# EAGLE design MAPE-CUN-Large-033 (EAGLE 7.3.0)
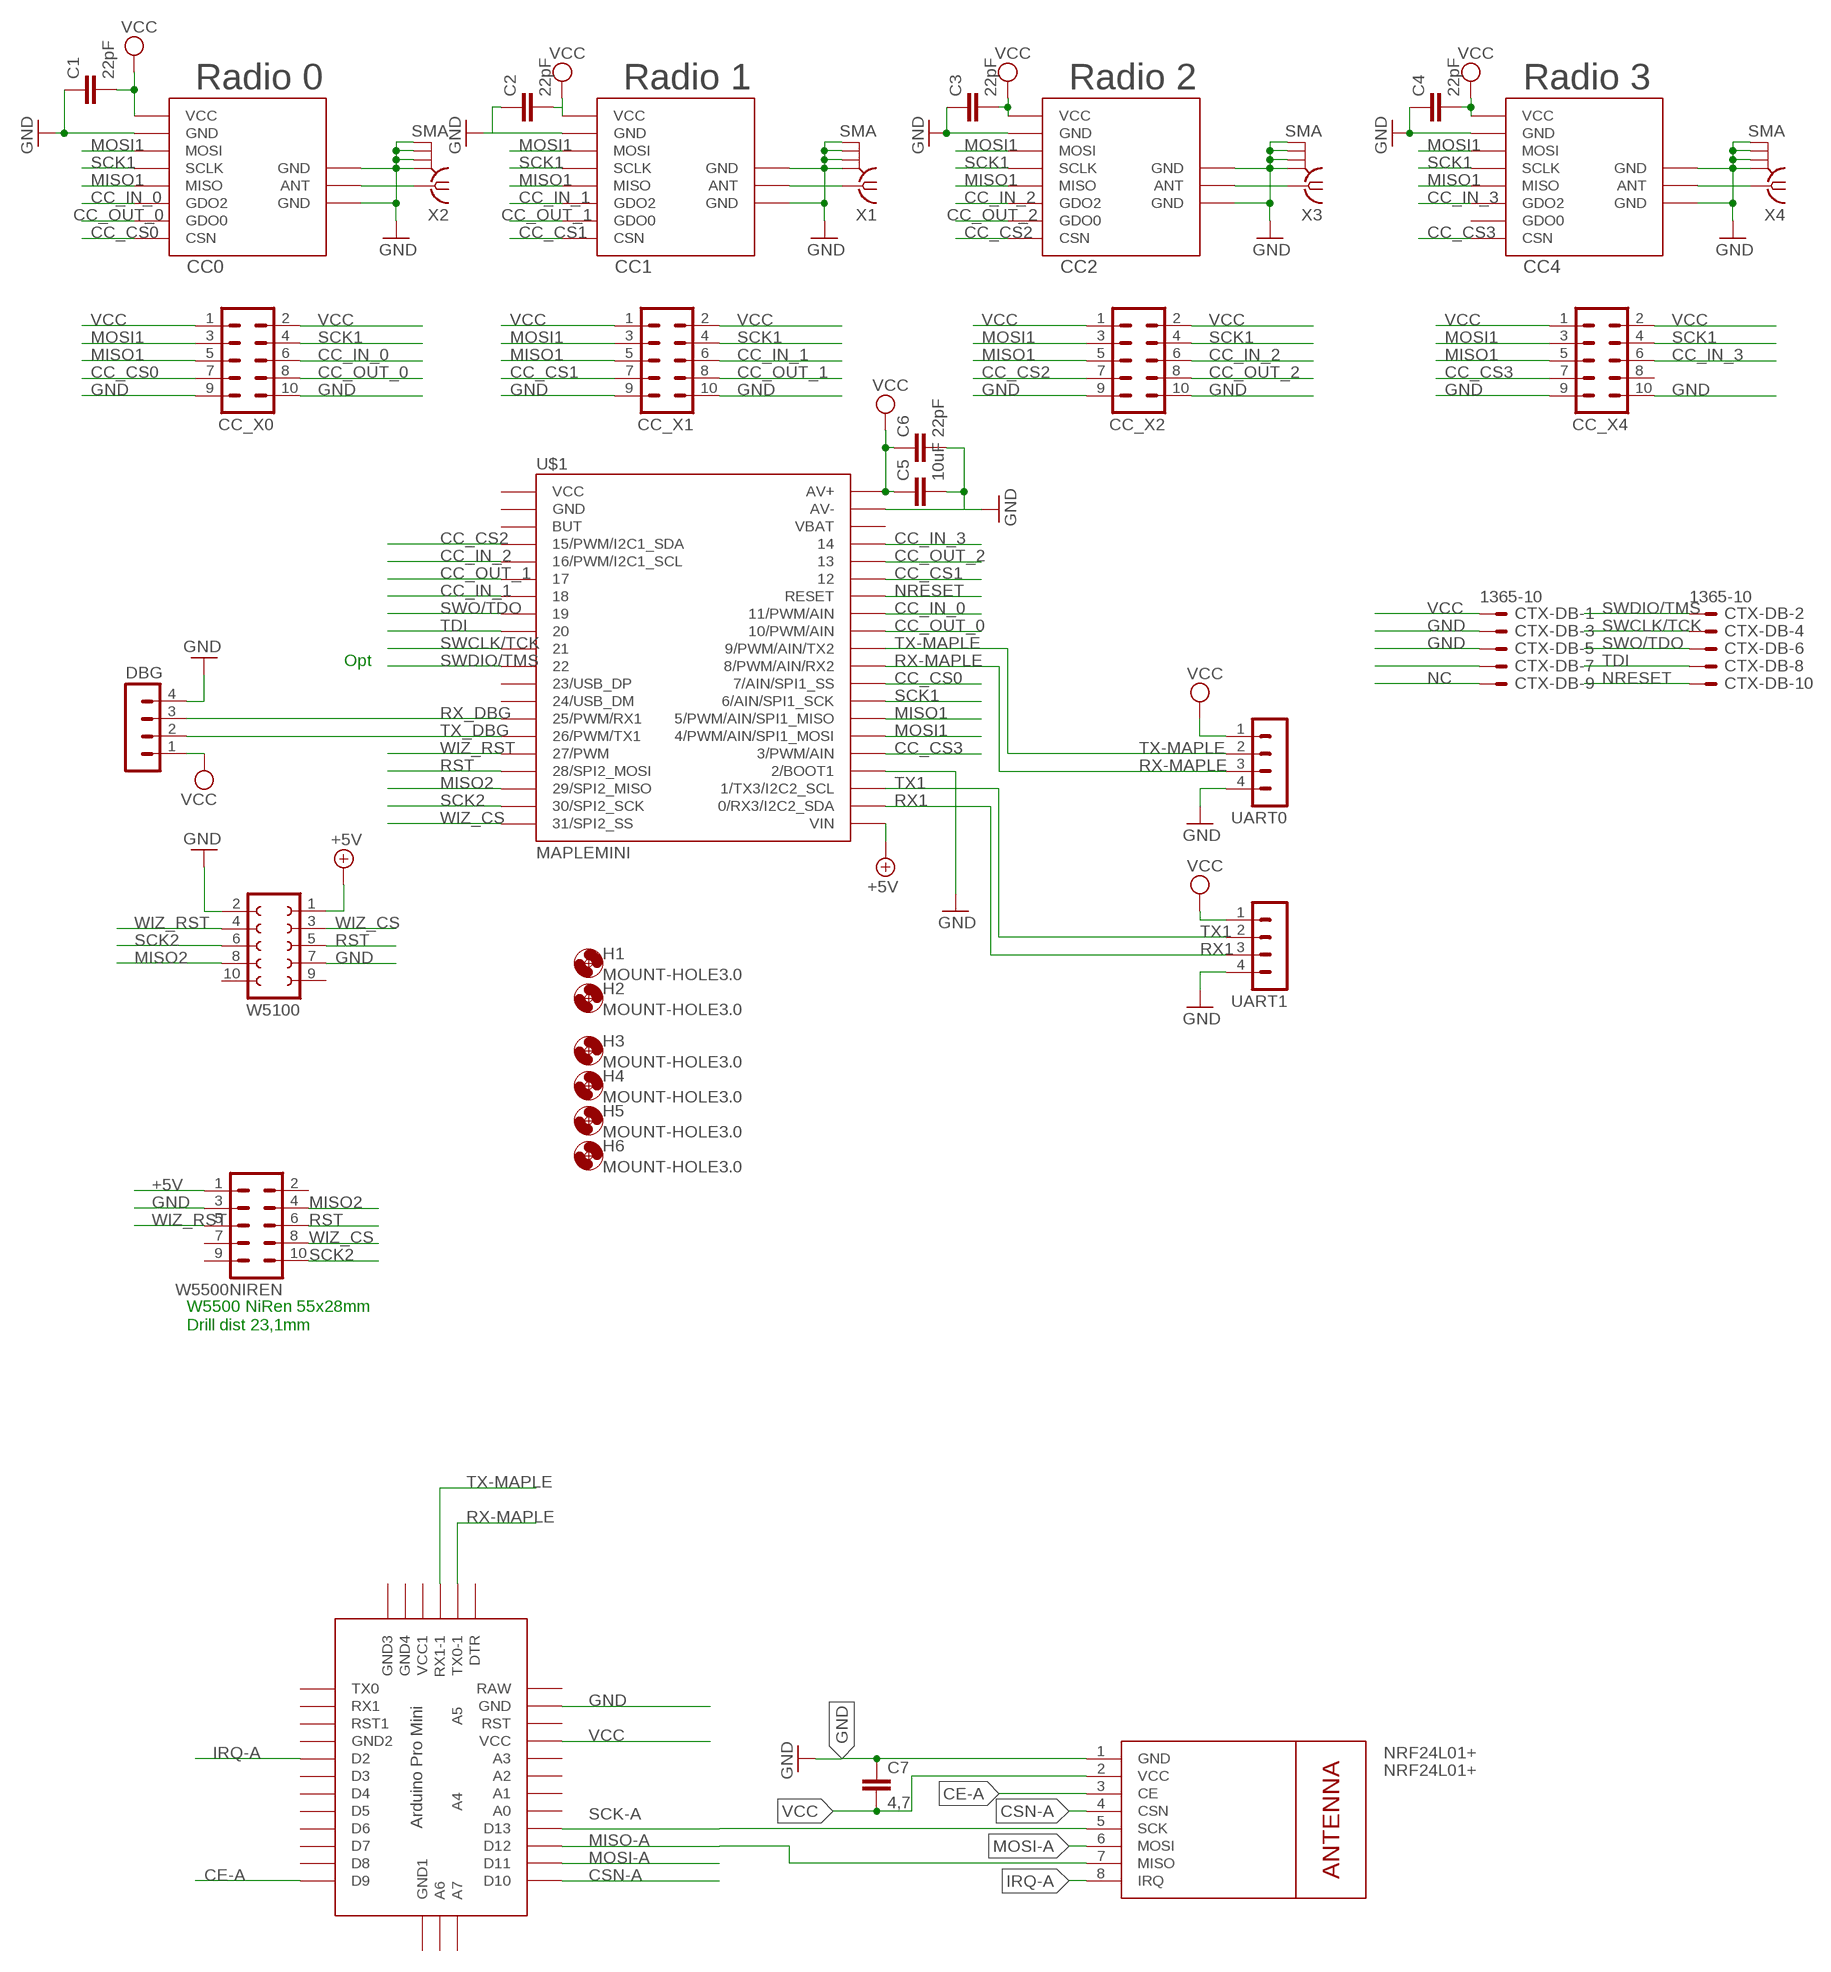
[diagram p0: schematic, sheet 1]

## Parts
C1  22pF  C-EUC0805  [C0805]
C2  22pF  C-EUC0805  [C0805]
C3  22pF  C-EUC0805  [C0805]
C4  22pF  C-EUC0805  [C0805]
C5  10uF  C-EUC1210  [C1210]
C6  22pF  C-EUC0805  [C0805]
C7  4,7  C-EUC1210  [C1210]
CC0  CC1101_MODULE1SMD  [CC1101_MODULE1_SMD]
CC1  CC1101_MODULE1SMD  [CC1101_MODULE1_SMD]
CC2  CC1101_MODULE1SMD  [CC1101_MODULE1_SMD]
CC4  CC1101_MODULE1SMD  [CC1101_MODULE1_SMD]
CC_X0  MA05-2  [MA05-2]
CC_X1  MA05-2  [MA05-2]
CC_X2  MA05-2  [MA05-2]
CC_X4  MA05-2  [MA05-2]
CTX-DB  1365-10  [1365-10]
DBG  MA04-1  [MA04-1]
H1  MOUNT-HOLE3.0  [3,0]
H2  MOUNT-HOLE3.0  [3,0]
H3  MOUNT-HOLE3.0  [3,0]
H4  MOUNT-HOLE3.0  [3,0]
H5  MOUNT-HOLE3.0  [3,0]
H6  MOUNT-HOLE3.0  [3,0]
NRF24L01+  NRF24L01+  WIRELESS-NRF24L01  [WIRELESS-NRF24L01]
U$1  MAPLEMINI  [20-DIP]
U$2  ABK-PRO-MINI  [ABK-PRO-MINI]
UART0  MA04-1  [MA04-1]
UART1  MA04-1  [MA04-1]
W5100  FE05-2  [FE05-2]
W5500NIREN  MA05-2  [MA05-2]
X1  SMA  [SMA]
X2  SMA  [SMA]
X3  SMA  [SMA]
X4  SMA  [SMA]

## Nets
+5V: U$1.21(VIN) W5100.1 W5500NIREN.1
CC_CS0: CC0.CSN CC_X0.7 U$1.29(7/AIN/SPI1_SS)
CC_CS1: CC1.CSN CC_X1.7 U$1.35
CC_CS2: CC2.CSN CC_X2.7 U$1.4(15/PWM/I2C1_SDA)
CC_CS3: CC4.CSN CC_X4.7 U$1.25(3/PWM/AIN)
CC_IN_0: CC0.GDO2 CC_X0.6 U$1.33(11/PWM/AIN)
CC_IN_1: CC1.GDO2 CC_X1.6 U$1.7
CC_IN_2: CC2.GDO2 CC_X2.6 U$1.5(16/PWM/I2C1_SCL)
CC_IN_3: CC4.GDO2 CC_X4.6 U$1.37
CC_OUT_0: CC0.GDO0 CC_X0.8 U$1.32(10/PWM/AIN)
CC_OUT_1: CC1.GDO0 CC_X1.8 U$1.6
CC_OUT_2: CC2.GDO0 CC_X2.8 U$1.36
CE-A: NRF24L01+.3(CE) U$2.D9
CSN-A: NRF24L01+.4(CSN) U$2.D10
GND: C1.1 C2.1 C3.1 C4.1 C5.2 C6.2 C7.1 CC0.GND@0(GND) CC0.GND@1(GND) CC0.GND@2(GND) CC1.GND@0(GND) CC1.GND@1(GND) CC1.GND@2(GND) CC2.GND@0(GND) CC2.GND@1(GND) CC2.GND@2(GND) CC4.GND@0(GND) CC4.GND@1(GND) CC4.GND@2(GND) CC_X0.9 CC_X0.10 CC_X1.9 CC_X1.10 CC_X2.9 CC_X2.10 CC_X4.9 CC_X4.10 CTX-DB.3 CTX-DB.5 DBG.4 NRF24L01+.1(GND) U$1.24(2/BOOT1) U$1.39(AV-) U$2.GND UART0.4 UART1.4 W5100.2 W5100.7 W5500NIREN.3 X1.GND@1 X1.GND@2 X1.GND@3 X1.GND@4 X2.GND@1 X2.GND@2 X2.GND@3 X2.GND@4 X3.GND@1 X3.GND@2 X3.GND@3 X3.GND@4 X4.GND@1 X4.GND@2 X4.GND@3 X4.GND@4
IRQ-A: NRF24L01+.8(IRQ) U$2.D2
MISO1: CC0.MISO CC1.MISO CC2.MISO CC4.MISO CC_X0.5 CC_X1.5 CC_X2.5 CC_X4.5 U$1.27(5/PWM/AIN/SPI1_MISO)
MISO2: U$1.18(29/SPI2_MISO) W5100.8 W5500NIREN.4
MISO-A: NRF24L01+.7(MISO) U$2.D12
MOSI1: CC0.MOSI CC1.MOSI CC2.MOSI CC4.MOSI CC_X0.3 CC_X1.3 CC_X2.3 CC_X4.3 U$1.26(4/PWM/AIN/SPI1_MOSI)
MOSI-A: NRF24L01+.6(MOSI) U$2.D11
N$1: CC2.ANT X3.1
N$2: CC4.ANT X4.1
N$3: CC1.ANT X1.1
N$4: CC0.ANT X2.1
N$8: CTX-DB.7
NC: CTX-DB.9
NRESET: CTX-DB.10 U$1.34(RESET)
RST: U$1.17(28/SPI2_MOSI) W5100.5 W5500NIREN.6
RX1: U$1.22(0/RX3/I2C2_SDA) UART1.3
RX-MAPLE: U$1.30(8/PWM/AIN/RX2) U$2.TX0-1 UART0.3
RX_DBG: DBG.3 U$1.14(25/PWM/RX1)
SCK1: CC0.SCLK CC1.SCLK CC2.SCLK CC4.SCLK CC_X0.4 CC_X1.4 CC_X2.4 CC_X4.4 U$1.28(6/AIN/SPI1_SCK)
SCK2: U$1.19(30/SPI2_SCK) W5100.6 W5500NIREN.10
SCK-A: NRF24L01+.5(SCK) U$2.D13
SWCLK/TCK: CTX-DB.4 U$1.10
SWDIO/TMS: CTX-DB.2 U$1.11
SWO/TDO: CTX-DB.6 U$1.8
TDI: CTX-DB.8 U$1.9
TX1: U$1.23(1/TX3/I2C2_SCL) UART1.2
TX-MAPLE: U$1.31(9/PWM/AIN/TX2) U$2.RX1-1 UART0.2
TX_DBG: DBG.2 U$1.15(26/PWM/TX1)
VCC: C1.2 C2.2 C3.2 C4.2 C5.1 C6.1 C7.2 CC0.VCC CC1.VCC CC2.VCC CC4.VCC CC_X0.1 CC_X0.2 CC_X1.1 CC_X1.2 CC_X2.1 CC_X2.2 CC_X4.1 CC_X4.2 CTX-DB.1 DBG.1 NRF24L01+.2(VCC) U$1.40(AV+) U$2.VCC UART0.1 UART1.1
WIZ_CS: U$1.20(31/SPI2_SS) W5100.3 W5500NIREN.8
WIZ_RST: U$1.16(27/PWM) W5100.4 W5500NIREN.5
Unconnected: CC4.GDO0 CC_X4.8 U$1.1(VCC) U$1.2(GND) U$1.3(BUT) U$1.12(23/USB_DP) U$1.13(24/USB_DM) U$1.38(VBAT) U$2.A0 U$2.A1 U$2.A2 U$2.A3 U$2.A4 U$2.A5 U$2.A6 U$2.A7 U$2.D3 U$2.D4 U$2.D5 U$2.D6 U$2.D7 U$2.D8 U$2.DTR U$2.GND1(GND2) U$2.GND2(GND3) U$2.GND3(GND4) U$2.GND4(GND1) U$2.RAW U$2.RST U$2.RST1 U$2.RX1 U$2.TX0 U$2.VCC1 W5100.9 W5100.10 W5500NIREN.2 W5500NIREN.7 W5500NIREN.9

## Notes on the sheet
- Radio 0 | Radio 1 | Radio 2 | Radio 3
- Opt
- W5500 NiRen 55x28mm
  Drill dist 23,1mm

## Library data of the parts
C1-C7 = rcl:C-EU: CAPACITOR, European symbol
CC0 CC1 CC2 CC4 = wireless:CC1101_MODULE1: CC1101 wireless module for 433/868 MHz (sold from Aliexpress). DIL version for mounting with pin header (and SMD soldering) and SMD only variant available.
CC_X0 CC_X1 CC_X2 CC_X4 W5500NIREN = con-lstb:MA05-2: PIN HEADER; OC_FARNELL: unknown; OC_NEWARK: unknown
CTX-DB = con-leotronics:1365-10: DUAL ROW STRAIGHT HEADER 1364 SERIES. 1.27mm x 1.27mm. Without Fixing Post. SMT Source: http://www.leotronics.co.uk/Conexcon/Data%20Sheets/sec.%20A/1364ing.pdf; OC_FARNELL: unknown; OC_NEWARK: unknown
DBG UART0 UART1 = con-lstb:MA04-1: PIN HEADER; OC_FARNELL: unknown; OC_NEWARK: unknown
H1-H6 = holes:MOUNT-HOLE: MOUNTING HOLE with drill center marker
NRF24L01+ = diy-modules:WIRELESS-NRF24L01: 2.4 GHz Wireless Module based on NRF24L01 chip
U$1 = maplemini-small:MAPLEMINI
U$2 = Arduino-clone:ABK-PRO-MINI: ABK Pro-Mini Arduino Clone
W5100 = con-lsta:FE05-2: FEMALE HEADER; OC_FARNELL: unknown; OC_NEWARK: unknown
X1-X4 = sma:SMA: SMA 50 Ohm end launch jack receptacle - round contact

## Net classes
0 default: width 0.406 mm
1 PWR: width 0.305 mm

## Board
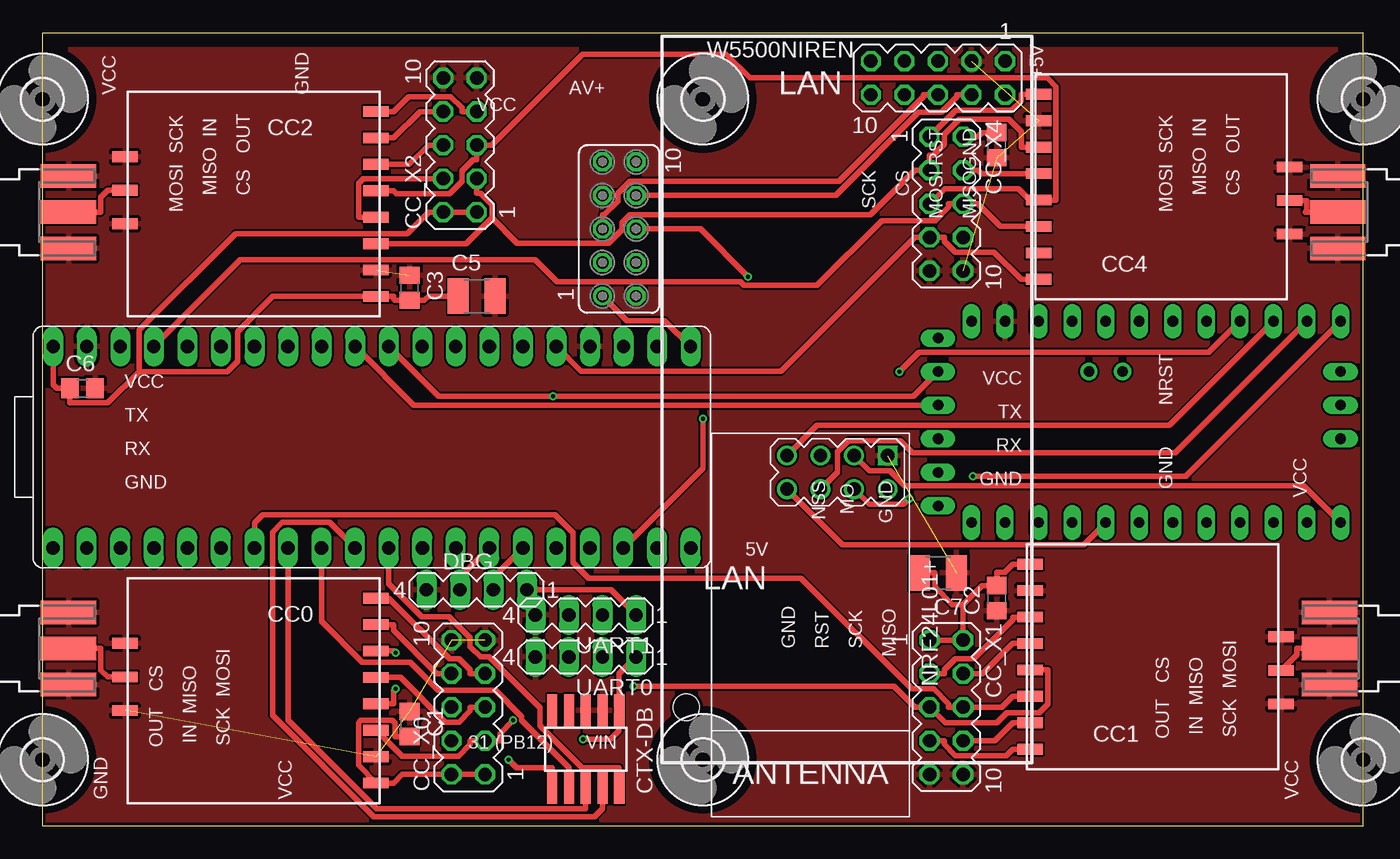
[diagram p1: board, top side]
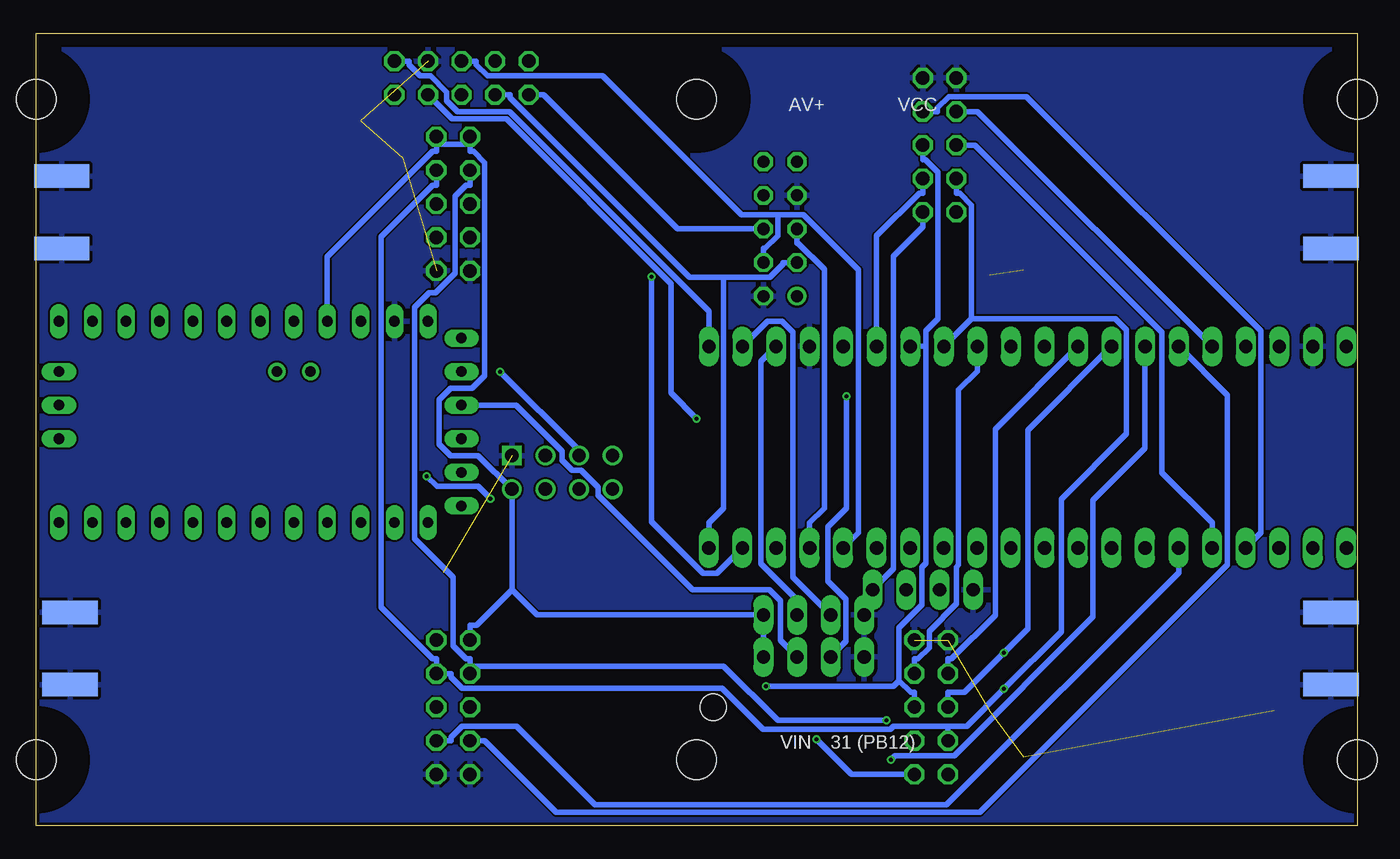
[diagram p2: board, bottom side, seen from below]

Size 100 x 60 mm. Coordinates in mm from the lower left corner, seen from the top.
Outline: 0,60 0,0 100,0 100,60 0,60
Copper layers (1*16): Top 0.035mm / dielectric 1.5mm / Bottom 0.035mm
Design rules "SeeedStudio_2layer_DRU_no_angle_20140221": minimum track width 6mil, minimum drill 12mil, track to track 6mil, track to pad 6mil, pad to pad 6mil, via to via 6mil, smd to smd 0mil, copper to edge 10mil, drill to drill 10mil, minimum pad ring 10mil, minimum via ring 6mil, stop-mask expansion 2mil, vias tented up to drill 100mil, thermal gap 10mil
Holes 2 mm at 48.76,8.97
tRestrict: area -0.1,59.1 to 100.2,59.8
bRestrict: area -0.1,59.1 to 100.2,59.8

### Footprints (pad centres in the part's own frame; a part is rotated, then mirrored left to right if it is on the bottom)
C0805 = smd 1.3 x 1.5: 1 -0.95,0; 2 0.95,0
C1210 = smd 1.6 x 2.7: 1 -1.4,0; 2 1.4,0
CC1101_MODULE1_SMD = smd 1.93 x 0.813: ANT 19,5.96; CSN 0,0; GDO0 0,2; GDO2 0,4; GND@0 0,12; GND@1 19,8.5; GND@2 19,3.42; MISO 0,6; MOSI 0,10; SCLK 0,8; VCC 0,14
MA05-2 = drill 1.016 octagon: 1 -5.08,-1.27; 2 -5.08,1.27; 3 -2.54,-1.27; 4 -2.54,1.27; 5 0,-1.27; 6 0,1.27; 7 2.54,-1.27; 8 2.54,1.27; 9 5.08,-1.27; 10 5.08,1.27
1365-10 = smd 0.76 x 2.4: 1 -2.54,-2.95; 2 -2.54,2.95; 3 -1.27,-2.95; 4 -1.27,2.95; 5 0,-2.95; 6 0,2.95; 7 1.27,-2.95; 8 1.27,2.95; 9 2.54,-2.95; 10 2.54,2.95
MA04-1 = drill 1.016 long: 1 -3.81,0; 2 -1.27,0; 3 1.27,0; 4 3.81,0
3,0 = hole 3: 0,0
WIRELESS-NRF24L01 = drill 1 square: 1 -12.7,6.35 | drill 1: 2 -10.16,6.35; 3 -12.7,3.81; 4 -10.16,3.81; 5 -12.7,1.27; 6 -10.16,1.27; 7 -12.7,-1.27; 8 -10.16,-1.27
20-DIP = drill 1.016 pad 1.27 long: 1 -24.13,-7.62; 2 -21.59,-7.62; 3 -19.05,-7.62; 4 -16.51,-7.62; 5 -13.97,-7.62; 6 -11.43,-7.62; 7 -8.89,-7.62; 8 -6.35,-7.62; 9 -3.81,-7.62; 10 -1.27,-7.62; 11 1.27,-7.62; 12 3.81,-7.62; 13 6.35,-7.62; 14 8.89,-7.62; 15 11.43,-7.62; 16 13.97,-7.62; 17 16.51,-7.62; 18 19.05,-7.62; 19 21.59,-7.62; 20 24.13,-7.62 | drill 1 pad 1.27 long: 21 24.13,7.62; 22 21.59,7.62; 23 19.05,7.62; 24 16.51,7.62; 25 13.97,7.62; 26 11.43,7.62; 27 8.89,7.62; 28 6.35,7.62; 29 3.81,7.62; 30 1.27,7.62; 31 -1.27,7.62; 32 -3.81,7.62; 33 -6.35,7.62; 34 -8.89,7.62; 35 -11.43,7.62; 36 -13.97,7.62; 37 -16.51,7.62; 38 -19.05,7.62; 39 -21.59,7.62; 40 -24.13,7.62
ABK-PRO-MINI = drill 0.8 long: A0 10.16,-3.81; A1 10.16,-6.35; A2 10.16,-8.89; A3 10.16,-11.43; A6 3.81,-21.59; A7 6.35,-21.59; D2 -5.08,-3.81; D3 -5.08,-6.35; D4 -5.08,-8.89; D5 -5.08,-11.43; D6 -5.08,-13.97; D7 -5.08,-16.51; D8 -5.08,-19.05; D9 -5.08,-21.59; D10 10.16,-21.59; D11 10.16,-19.05; D12 10.16,-16.51; D13 10.16,-13.97; DTR 8.89,8.89; GND 10.16,3.81; GND1 -5.08,-1.27; GND2 -3.81,8.89; GND3 -1.27,8.89; GND4 1.27,-21.59; RAW 10.16,6.35; RST 10.16,1.27; RST1 -5.08,1.27; RX1 -5.08,3.81; RX1-1 3.81,8.89; TX0 -5.08,6.35; TX0-1 6.35,8.89; VCC 10.16,-1.27; VCC1 1.27,8.89 | drill 0.8: A4 6.35,-5.08; A5 6.35,-2.54
FE05-2 = drill 0.914: 1 -5.08,1.27 | drill 0.914 octagon: 2 -5.08,-1.27; 3 -2.54,1.27; 4 -2.54,-1.27; 5 0,1.27; 6 0,-1.27; 7 2.54,1.27; 8 2.54,-1.27; 9 5.08,1.27; 10 5.08,-1.27
SMA = smd 4.191 x 1.778: 1 2.115,0; GND@1 2.115,2.733; GND@2 2.115,-2.733 | smd 4.191 x 1.778 bottom: GND@3 2.115,2.733; GND@4 2.115,-2.733

### Placement (x,y rotation side)
C1  27.8,7.71 270 top
C2  72.25,17.23 90 top
C3  27.8,40.73 270 top
C4  72.25,51.52 90 top
C5  32.88,40.09 0 top
C6  3.03,33.11 0 top
C7  67.8,19.13 180 top
CC0  25.26,17.23 180 top
CC1  74.79,5.8 0 top
CC2  25.26,54.06 180 top
CC4  75.42,41.36 0 top
CC_X0  32.24,8.97 90 top
CC_X1  68.44,8.97 270 top
CC_X2  31.61,51.52 90 top
CC_X4  68.44,47.08 270 top
CTX-DB  41.13,5.8 180 top
DBG  32.88,17.86 180 top
H1  100,5 0 top
H2  100,55 90 top
H3  0,5 0 top
H4  0,55 0 top
H5  50,5 0 top
H6  50,55 0 top
NRF24L01+  57.64,15.32 270 top
U$1  24.94,28.66 0 top
U$2  76.69,28.02 90 top
UART0  41.13,12.79 180 top
UART1  41.13,15.96 180 top
W5100  43.67,45.17 90 top
W5500NIREN  67.8,56.6 180 top
X1  99.55,13.42 180 top
X2  -0.14,13.42 0 top
X3  -0.14,46.44 0 top
X4  100.19,46.44 180 top

### Tracks (layer width: path | path; a pad name or v marks a point on that pad's centre or on a via)
+5V
  Top 0.406: W5100.1 44.26,38.24 47.12,38.24 U$1.21
  Bottom 0.406: U$1.21 49.07,38.14 49.07,38.96 64.18,54.06 68.12,54.06 68.92,54.86 68.92,55.53 70.14,56.75 70.93,56.75 71.77,57.59 71.77,57.87 W5500NIREN.1
CC_CS0
  Top 0.406: CC_X0.7 32.4,11.51 32.4,11.79 31.56,12.63 30.82,12.63 26.22,17.23 CC0.CSN
  Bottom 0.406: U$1.29 28.75,34.42 30.17,33 30.17,19.74 30.34,19.57 30.34,16.79 32.4,14.73 32.4,13.48 33.24,12.63 33.52,12.63 CC_X0.7
CC_CS1
  Top 0.406: CC1.CSN 73.47,5.8 72.98,5.32 69.13,5.32 68.29,6.16 68.29,6.44 CC_X1.7
  Bottom 0.406: CC_X1.7 66.05,6.44 60.65,1.03 28.57,1.03 9.82,19.77 9.82,32.59 U$1.35
CC_CS2
  Top 0.406: CC2.CSN 26.58,54.06 27.71,55.19 30.91,55.19 31.76,54.34 31.76,54.06 CC_X2.7
  Bottom 0.406: CC_X2.7 31.76,54.06 31.76,54.33 30.9,55.19 25.02,55.19 7.28,37.45 7.28,22.19 U$1.4
CC_CS3
  Top 0.406: U$1.25 40.8,34.4 55.91,34.4 66.05,44.54 CC_X4.7 68.29,44.54 68.29,44.26 69.13,43.42 72.05,43.42 74.1,41.36 CC4.CSN
CC_IN_0  (via drill 0.3 pad 0.61)
  Top 0.406: CC0.GDO2 26.58,13.23 26.7,13.11 v26.73,13.11
  Bottom 0.406: U$1.33 24.94,29.93 24.94,14.9 v26.73,13.11 29.75,10.09 30.97,10.09 CC_X0.6
CC_IN_1
  Top 0.406: U$1.7 16.05,22.92 16.66,23.52 38.83,23.52 40.18,22.17 40.18,19.91 41.35,18.75 57.44,18.75 65.82,10.36 67.48,10.36 68.59,9.25 68.59,8.97 CC_X1.6 72.64,8.97 73.47,9.8 CC1.GDO2
CC_IN_2
  Top 0.406: CC_X2.6 29.22,51.52 27.76,50.06 CC2.GDO2
  Bottom 0.406: U$1.5 10.97,22.92 14.78,26.73 14.78,37.36 28.94,51.52 CC_X2.6
CC_IN_3
  Top 0.406: U$1.37 14.97,42.82 37.32,42.82 38.96,41.18 52.86,41.18 53.13,40.91 58.65,40.91 63.55,45.8 67.6,45.8 68.59,46.8 68.59,47.08 CC_X4.6 70.83,47.08 72.54,45.36 74.1,45.36 CC4.GDO2
CC_OUT_0
  Top 0.406: CC0.GDO0 26.58,15.23 26.58,14.79 29.86,11.51 CC_X0.8
  Bottom 0.406: CC_X0.8 30.97,12.63 30.7,12.63 27.38,15.95 27.38,30.03 U$1.32
CC_OUT_1
  Top 0.406: CC1.GDO0 73.47,7.8 72.1,6.44 CC_X1.8
  Bottom 0.406: U$1.6 13.51,19.16 31.08,1.59 57.69,1.59 63.65,7.55 67.75,7.55 68.59,6.71 68.59,6.44 CC_X1.8
CC_OUT_2
  Top 0.406: CC2.GDO0 26.58,52.06 28.58,54.06 CC_X2.8
  Bottom 0.406: U$1.36 28.75,54.06 CC_X2.8
CE-A
  Top 0.406: U$2.D9 95.48,25.75 65.3,25.75 64.17,26.87 62.61,26.87 NRF24L01+.3
CSN-A  (via drill 0.3 pad 0.61)
  Top 0.406: v65.62,24.76 65.19,24.32 62.62,24.32 NRF24L01+.4 | U$2.D10 86.57,26.47 v70.45,26.47
  Bottom 0.406: v70.45,26.47 69.67,25.68 66.55,25.68 v65.62,24.76
GND  (9 unrouted)
  pour Bottom: -0.14,59.78 -0.14,0.08 100.19,0.08 100.19,59.78
  pour Top: -0.14,0.08 -0.14,59.78 100.19,59.78 100.19,0.08
IRQ-A
  Top 0.406: U$2.D2 78.84,21.28 60.58,21.28 NRF24L01+.8
MISO1  (via drill 0.3 pad 0.61)
  Top 0.406: v44.75,10.56 64.47,10.56 66.05,8.97 CC_X1.5 68.36,7.79 72.25,7.79 73.02,8.56 75.47,8.56 76.11,9.2 76.11,11.8 CC1.MISO | CC_X0.5 32.4,8.97 32.4,8.7 31.56,7.85 30.5,7.85 27.13,11.23 CC0.MISO | CC2.MISO 26.58,48.06 26.8,47.84 30.83,47.84 31.76,48.78 31.76,49.56 32.6,50.4 32.88,50.4 CC_X2.5 34,51.52 40.89,58.41 51.75,58.41 53.56,56.6 76.07,56.6 76.75,55.92 76.75,47.36 76.61,47.36 CC4.MISO 75.09,47.36 74.77,47.36 73.9,48.22 68.32,48.22 CC_X4.5
  Bottom 0.406: 34.67,10.97 33.79,10.09 33.52,10.09 CC_X0.5 | 32.66,36.28 32.66,19.87 32.96,19.57 32.96,16.71 34.67,15 34.67,10.97 | v44.75,10.56 35.09,10.56 34.67,10.97 | 32.66,36.28 U$1.27 | 32.66,36.28 32.66,37.45 31.75,38.37 31.75,49.48 32.67,50.4 32.88,50.4 CC_X2.5
MISO2  (via drill 0.3 pad 0.61)
  Top 0.406: v50,30.82 50,27.05 U$1.18 | W5100.8 46.01,47.71 60.06,47.71 66.34,53.99 68.05,53.99 69.23,55.17 69.23,55.33 W5500NIREN.4
  Bottom 0.406: W5500NIREN.4 68.52,53.5 64.41,53.5 51.94,41.04 51.94,32.76 v50,30.82
MISO-A
  Top 0.406: U$2.D12 85.33,30.31 58.66,30.31 NRF24L01+.7
MOSI1  (via drill 0.3 pad 0.61)
  Top 0.406: v35.62,7.97 34.63,6.98 34.63,6.44 CC_X0.3 32.4,6.44 32.4,6.16 31.5,5.26 27.23,5.26 CC0.MOSI | 34.03,46.01 32.08,44.06 CC2.MOSI | 34.03,46.01 34.03,46.99 33.16,47.86 32.88,47.86 CC_X2.3 | 34.03,46.01 35.94,44.1 42.88,44.1 43.88,45.1 43.88,45.65 44.49,46.26 62.69,46.26 66.05,49.62 CC_X4.3 67.17,50.73 67.45,50.73 68.29,51.57 68.29,52.35 69.41,53.48 73.17,53.48 74.1,52.54 74.1,51.36 CC4.MOSI | CC1.MOSI 73.47,15.8 73.47,15.59 70.52,12.63 69.13,12.63 68.29,11.79 68.29,11.51 CC_X1.3
  Bottom 0.406: 67.17,12.07 47.95,12.07 43.85,7.97 v35.62,7.97 | 67.17,12.07 67.17,12.63 67.44,12.63 68.44,13.63 68.44,18.8 71.37,21.74 71.37,39.25 70.28,40.35 69.77,40.35 68.29,41.83 68.29,47.66 67.45,48.5 67.17,48.5 CC_X4.3 | CC_X1.3 67.17,12.07 | CC_X2.3 32.88,47.86 33.15,47.86 36.37,44.64 U$1.26
MOSI-A
  Top 0.406: U$2.D11 85.79,28.23 65.86,28.23 64.95,29.15 61.01,29.15 60.19,28.33 60.19,26.75 NRF24L01+.6
N$1
  Top 0.406: X3.1 4.43,46.44 4.43,47.59 4.94,48.1 CC2.ANT
N$2
  Top 0.406: CC4.ANT 95.75,47.32 95.75,46.56 95.62,46.44 X4.1
N$3
  Top 0.406: X1.1 94.99,13.42 94.99,12.96 CC1.ANT
N$4
  Top 0.406: CC0.ANT 4.94,11.27 4.43,11.78 4.43,13.42 X2.1
NRESET  (via drill 0.3 pad 0.61)
  Top 0.406: CTX-DB.10 38.59,4.41 35.91,4.41 v35.31,5.01
  Bottom 0.406: U$1.34 16.05,28.56 19.99,24.63 19.99,15.83 30.5,5.32 35,5.32 v35.31,5.01
RST
  Top 0.406: W5100.5 42.41,46.24 42.54,46.24 43.58,47.28 43.58,47.87 44.49,48.78 60.29,48.78 66.69,55.17 66.69,55.33 W5500NIREN.6
  Bottom 0.406: U$1.17 41.45,22.92 40.34,24.03 40.34,42.13 42.31,44.1 42.41,44.1 W5100.5
RX1
  Bottom 0.406: UART1.3 42.72,18.82 42.72,37.37 43.53,38.18 44.63,38.18 U$1.22
RX-MAPLE  (via drill 0.3 pad 0.61)
  Top 0.406: U$2.TX0-1 65.93,32.5 v38.67,32.5 29.99,32.5 U$1.30
  Bottom 0.406: UART0.3 38.69,13.96 38.69,17.14 40.06,18.51 40.06,22.64 38.67,24.03 v38.67,32.5
RX_DBG
  Top 0.406: U$1.14 31.61,18.82 DBG.3
SCK1  (via drill 0.3 pad 0.61)
  Top 0.406: CC_X4.4 70.83,49.62 71.08,49.36 CC4.SCLK | CC0.SCLK 26.58,9.23 26.58,10.21 v26.74,10.36 | CC1.SCLK 73.47,13.8 71.18,11.51 CC_X1.4 | CC2.SCLK 23.94,46.06 23.94,48.64 24.28,48.98 CC_X2.4
  Bottom 0.406: 30.97,7.55 35.11,7.55 35.35,7.31 44.98,7.31 48.07,10.4 67.75,10.4 68.59,11.24 68.59,11.51 CC_X1.4 69.71,12.63 69.98,12.63 73.9,16.55 73.9,44.59 69.99,48.5 69.71,48.5 CC_X4.4 | 30.97,7.55 29.54,7.55 v26.74,10.36 22.4,14.69 22.4,24.73 17.46,29.66 17.46,37.54 18.31,38.39 29.18,38.39 | 29.18,38.39 U$1.28 | 29.18,38.39 29.18,46.98 30.07,47.86 30.34,47.86 CC_X2.4 | CC_X0.4 30.97,7.55
SCK2  (via drill 0.3 pad 0.61)
  Top 0.406: W5100.6 49.81,45.17 v53.41,41.57
  Bottom 0.406: v53.41,41.57 53.41,23.02 49.51,19.12 48.45,19.12 U$1.19 | W5500NIREN.10 61.61,55.33 51.45,45.17 W5100.6
SCK-A  (via drill 0.3 pad 0.61)
  Top 0.406: U$2.D13 88.32,35.84 66.35,35.84 v64.89,34.38
  Bottom 0.406: v64.89,34.38 58.91,28.41 NRF24L01+.5
SWCLK/TCK
  Top 0.406: CTX-DB.4 42.41,1.29 41.81,0.7 25.09,0.7 17.43,8.36 17.43,22.22 18.17,22.96 21.75,22.96 U$1.10
SWDIO/TMS
  Top 0.406: CTX-DB.2 43.67,4.41 40.85,4.41 37.66,7.59 37.66,8.95 33.83,12.79 33.16,12.79 32.4,13.55 32.4,14.21 30.78,15.83 28.7,15.83 26.21,18.32 U$1.11
SWO/TDO
  Top 0.406: CTX-DB.6 41.13,1.29 25.3,1.29 18.59,8.01 U$1.8
TDI
  Top 0.406: U$1.9 21.13,15.47 24.22,12.39 27.82,12.39 29.96,10.24 34.29,10.24 36.28,8.25 36.28,7.99 39.87,4.41 CTX-DB.8
TX1
  Bottom 0.406: U$1.23 45.12,35.15 45.12,19.83 42.41,17.11 UART1.2
TX-MAPLE
  Top 0.406: U$2.RX1-1 66.14,31.83 28.12,31.83 U$1.31
  Bottom 0.406: UART0.2 43.67,14.05 43.67,17.04 44.49,17.85 50.32,17.85 57.48,25.02 57.48,25.64 58.76,26.91 59.43,26.91 60.19,27.67 60.19,28.34 63.68,31.83 U$2.RX1-1
TX_DBG
  Top 0.406: U$1.15 34.15,18.82 DBG.2
VCC  (via drill 0.3 pad 0.61)
  Top 0.406: v40.92,6.54 43.03,6.54 43.67,7.19 CTX-DB.1 43.67,11.51 UART0.1 | 69.71,16.75 CC_X1.2 68.29,14.05 CC_X1.1 | DBG.1 43.04,17.86 UART1.1 | CC_X0.1 CC_X0.2 27.25,3.9 26.58,3.23 CC0.VCC 23.93,4.56 23.93,7.81 24.11,7.99 26.46,7.99 26.69,7.76 26.69,6.75 C1.2 | CC4.VCC 74.1,55.36 74.1,54.88 73.37,54.15 69.17,54.15 CC_X4.1 | 7.32,34.38 13.99,34.38 14.78,35.18 14.78,37.39 17.45,40.06 CC2.VCC 26.58,40.06 26.58,39.89 26.69,39.78 C3.2 28.91,39.78 29.22,40.09 30.32,40.09 C5.1 | 7.32,34.38 4.94,32 2.08,32 C6.1 1.08,33.11 0.81,33.37 U$1.40 | 7.32,34.38 7.32,37.53 14.62,44.82 27.6,44.82 29.22,46.44 CC_X2.2 CC_X2.1 | C7.2 67.56,19.13 67.56,18.09 68.91,16.75 69.71,16.75 | 69.71,16.75 71.14,18.18 C2.2 72.25,19.19 72.86,19.19 73.47,19.8 CC1.VCC | C4.2 71.14,52.47 70.83,52.16 CC_X4.2
  Bottom 0.406: v40.92,6.54 38.27,3.9 CC_X0.1 | UART0.1 UART1.1 62.1,15.96 64,17.86 | 64,17.86 NRF24L01+.2 66.53,28.02 68.63,28.02 69.49,28.89 69.49,32.24 68.62,33.11 66.99,33.11 66.04,34.05 66.04,50.18 66.9,51.04 67.17,51.04 67.17,51.6 | 64,17.86 66.68,15.17 67.17,15.17 CC_X1.1 | CC_X4.1 67.17,51.6 | 69.71,51.6 69.71,51.04 69.98,51.04 77.97,43.06 U$2.VCC | CC_X4.2 69.71,51.6 | 69.71,51.6 67.17,51.6 | CC_X2.1 32.88,45.32 35.1,43.1 35.1,19.45 DBG.1
WIZ_CS
  Bottom 0.406: U$1.20 49.07,22.92 47.96,24.03 47.96,41.52 | 47.96,41.52 44.45,41.52 43.47,42.5 43.47,42.63 W5100.3 | 47.96,41.52 50.55,41.52 64.15,55.11 64.15,55.33 W5500NIREN.8
WIZ_RST
  Bottom 0.406: 43.86,46.24 41.9,46.24 37.76,42.09 37.76,22.19 U$1.16 | 43.86,46.24 46.59,46.24 57.11,56.75 65.85,56.75 66.69,57.59 66.69,57.87 W5500NIREN.5 | 43.86,46.24 43.86,44.65 44.81,43.7 44.95,43.7 W5100.4

### Text on the board
tNames: GND | +5V | VCC | GND | AV+ | LAN | VCC | IN | RST | GND | IN | SCK | OUT | SCK | OUT | SCK | CS | MOSI | MISO | MISO | CS | MISO | CS | MOSI | MOSI | VCC | VCC | TX | NRST | TX | RX | RX | NSS | GND | GND | GND | GND | VCC | MO | 5V | LAN | MOSI | MOSI | GND | RST | SCK | CS | MISO | MISO | CS | MISO | OUT | SCK | OUT | SCK | IN | IN | 31 (PB12) | VIN | GND | VCC | VCC
bNames: VCC | AV+ | 31 (PB12) | VIN